# Altium schematic sheet SDcard.SchDoc
size A4
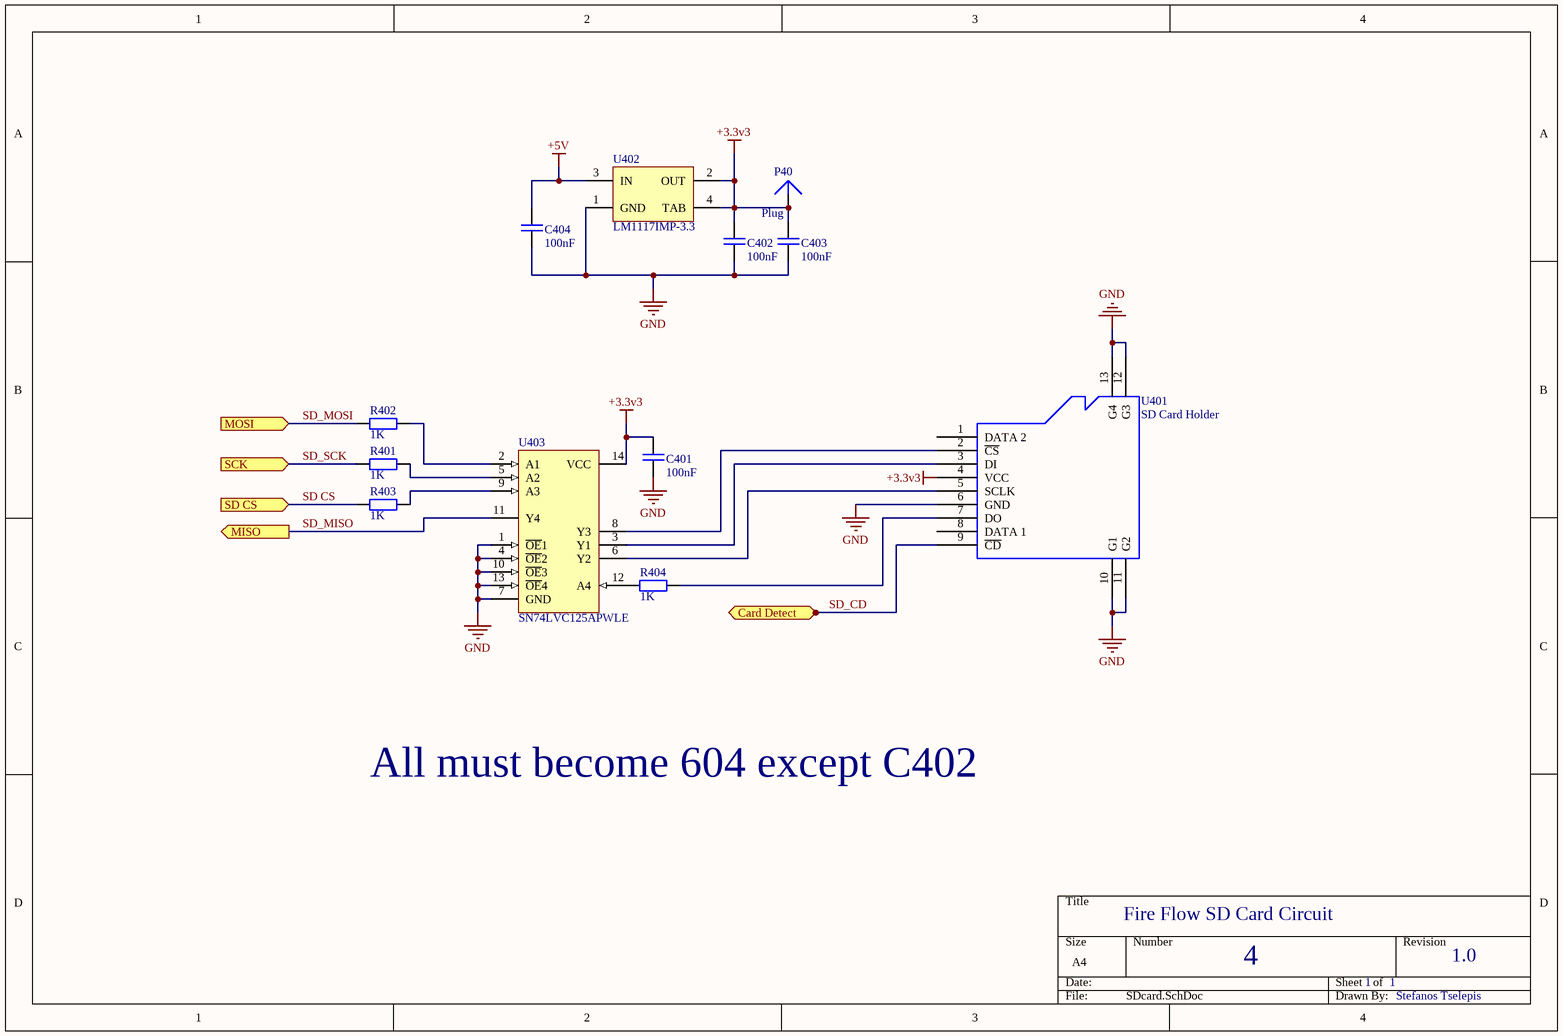
[diagram p0: SDcard.SchDoc]

## Parts
C401  100nF  [CC2013-0805]
C402  100nF  [CC2013-0805]
C403  100nF  [CC2013-0805]
C404  100nF  [CC2013-0805]
P40  Plug  [PIN1]
R401  1K  [CR2012-0805]
R402  1K  [CR2012-0805]
R403  1K  [CR2012-0805]
R404  1K  [CR2012-0805]
U401  SD Card Holder  [Micro SD Card holder]
U402  LM1117IMP-3.3  [MP04A_N]
U403  SN74LVC125APWLE  [PW014_N]

## Ports
Card Detect (out), MISO (out), MOSI (in), SCK (in), SD CS (in)

## Nets
+3.3v3: C401.1 C402.1 C403.1 P40.1 U401.4(VCC) U402.2(OUT) U402.4(TAB) U403.14(VCC)
+5V: C404.1 U402.3(IN)
GND: C401.2 C402.2 C403.2 C404.2 U401.6(GND) U401.10(G1) U401.11(G2) U401.12(G3) U401.13(G4) U402.1(GND) U403.1(~{OE}1) U403.4(~{OE}2) U403.7(GND) U403.10(~{OE}3) U403.13(~{OE}4)
SD CS: R403.2 ; port SD CS
SD_CD: U401.9(~{CD}) ; port Card Detect
SD_MISO: U403.11(Y4) ; port MISO
SD_MOSI: R402.2 ; port MOSI
SD_SCK: R401.2 ; port SCK
NetR401_1: R401.1 U403.5(A2)
NetR402_1: R402.1 U403.2(A1)
NetR403_1: R403.1 U403.9(A3)
NetR404_1: R404.1 U403.12(A4)
NetR404_2: R404.2 U401.7(DO)
NetU401_2: U401.2(~{CS}) U403.8(Y3)
NetU401_3: U401.3(DI) U403.3(Y1)
NetU401_5: U401.5(SCLK) U403.6(Y2)

Not connected (* = marked no-connect by the designer): U401 1(DATA_2) 8(DATA_1)

## Notes on the sheet
- All must become 604 except C402
- Fire Flow SD Card Circuit
- 4
- 1
- 1.0
- Stefanos Tselepis

## Library data of the parts
C401-C404 = Cap Metal Film: Value: 100nF
R401-R404 = Resistor: Value: 1K
U402 = LM1117IMP-3.3: 800mA Low-Dropout Linear Regulator, 4-pin SOT-223; Manufacturer: National Semiconductor; PackageTopMarking: XYTT*N05B; PowerWise: N; CompType: LDO IC; Published: 4-Dec-2008; DatasheetVersion: Apr-2006; PackageVersion: revB, Apr-2003; PackageReference: MP04A; Publisher: Altium Limited; PackageDescription: Molded SOT-223, 6.50 x 3.56 x 1.6mm Body, 4 Lead, 2.3mm Pitch; PartNumber: LM1117IMP-3.3; RoHS: N; PinCount: 4; Code_JEDEC: TO-261-AA; Code_IPC: SOT223-4; ComponentLink1Description: LM1117 Datasheet; ComponentLink1URL: http://www.national.com/ds/LM/LM1117.pdf; ComponentLink2Description: LM1117 Web Page; ComponentLink2URL: http://www.national.com/pf/LM/LM1117.html; ComponentLink3Description: MP04A Package Page; ComponentLink3URL: http://www.national.com/packaging/folders/mp04a.html
U403 = SN74LVC125APWLE: Quadruple Bus Buffer Gate with 3-State Outputs
P40 = Plug: LatestRevisionDate: 17-Jul-2002; LatestRevisionNote: Re-released for DXP Platform.; Publisher: Altium Limited